# Altium schematic sheet Reference.SchDoc
size A4; CompanyName: Technische Hochschule Nürnberg Georg Simon Ohm; Organization: UltraZohm; Address1: Kesslerplatz 12; Address2: 90489 Nürnberg; Address3: GERMANY; SheetNumber: 4; SheetTotal: 8; Website: www.ultrazohm.com
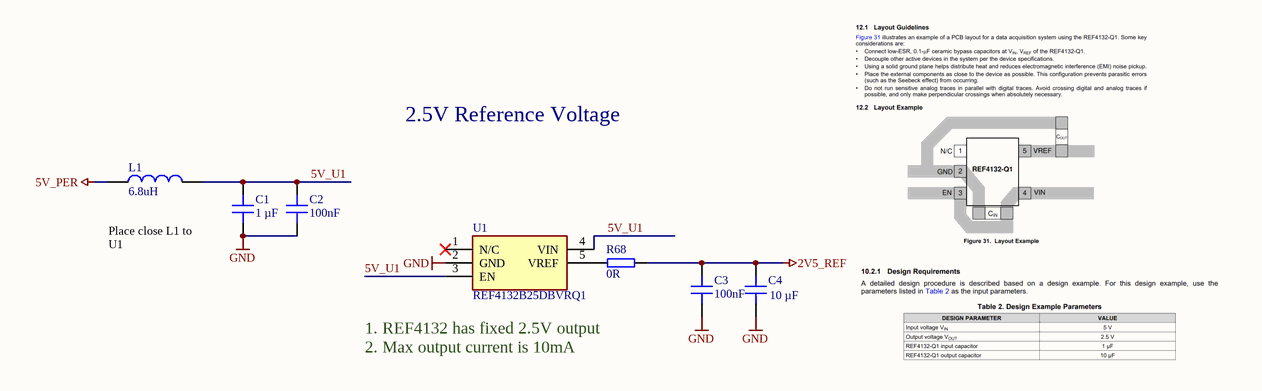
[diagram p0: Reference.SchDoc]

## Parts
C1  1 µF  [C_0603]
C2  100nF  [C_0603]
C3  100nF  [C_0603]
C4  10 µF  [C_0805]
L1  6.8uH  [INDC1608X95N]
R68  0R  [RES 0603_1608]
U1  REF4132B25DBVRQ1  [SOT95P280X145-5N]

## Nets
2V5_REF: C3.2 C4.2 R68.2
5V_PER: L1.1
GND: C1.1 C2.1 C3.1 C4.1 U1.2(GND)
5V_U1: C1.2 C2.2 L1.2 U1.3(EN) U1.4(VIN)
NetR68_1: R68.1 U1.5(VREF)

Not connected (* = marked no-connect by the designer): U1 1(N/C)*

## Notes on the sheet
- 2.5V Reference Voltage
- Place close L1 to U1
- 1. REF4132 has fixed 2.5V output
  2. Max output current is 10mA
- Title
- Revision:
- Design Engineer:
- Date:
- Project:
- Sheet
- of

## Library data of the parts
C1 = UMK107AB7105KA-T: 50V 1uF X7R ±10% 0603 Multilayer Ceramic Capacitors MLCC - SMD/SMT ROHS; Manufacturer: Taiyo Yuden; Voltage Rating: 50 VDC; Created from: NDiringer; Manufacturer Part Number: UMK107AB7105KA-T; PartID: 98; Created On: 8/9/2022 9:35:02 AM; ComponentLink1Description: Datasheet; ComponentLink1URL: https://www.mouser.de/datasheet/2/396/mlcc02_e-1307760.pdf; Component Type: Capacitor 0603; Device Package: 0603; Last Updated: 9/21/2022 4:11:37 PM; Mounting Type: SMD; Operating Temperature: -55 - 125°C; Series: X7R; Supplier 1: LCSC; Supplier Part Number 1: C105174; Type: Capacitor; Tolerance: 10 %; Value: 1 µF; Live Cycle Status: 1; Stock number: not stored; LCSC Part Number: C105174; Supplier 2: Mouser; Supplier Part Number 2: 963-UMK107AB7105MA-T
C2 C3 = CGA3E3X8R1H104KT0Y0N: 50V 100nF X8R ±10% 0603; Manufacturer: TDK; Voltage Rating: 50 VDC; Created from: KIlhan; Manufacturer Part Number: CGA3E3X8R1H104KT0Y0N; PartID: 131; Created On: 7/5/2023 7:32:58 PM; ComponentLink1Description: Datasheet; ComponentLink1URL: https://datasheet.lcsc.com/lcsc/2304140030_TDK-CGA3E3X8R1H104KT0Y0N_C342825.pdf; Component Type: Capacitor 0603; Device Package: 0603; Last Updated: 7/5/2023 7:32:58 PM; Mounting Type: SMD; Operating Temperature: -55 - 125°C; Series: CGA; Supplier 1: LCSC; Supplier Part Number 1: C342825; Type: Capacitor; Tolerance: 10 %; Value: 100nF; Live Cycle Status: 1; Stock number: not stored; LCSC Part Number: C342825
C4 = GRM219R61E106KA12D: Capacitor 0805, 25 VDC, 10 µF, X5R; Manufacturer: muRata; Tolerance: 10 %; Voltage Rating: 25 VDC; Created from: MGremer; Manufacturer Part Number: GRM219R61E106KA12D; PartID: 13; Created On: 12/20/2020 1:54:13 PM; ComponentLink1Description: Datasheet; ComponentLink1URL: https://www.mouser.de/datasheet/2/281/murata_03052018_GRM_Series_1-1310166.pdf; Component Type: Capacitor 0805; Device Package: 0805; Last Updated: 5/27/2022 2:14:39 PM; Mounting Type: SMD; Operating Temperature: -55 - 85°C; Series: GRM; Supplier 1: Mouser; Supplier Part Number 1: 81-GRM219R61E106KA2D; Type: Capacitor; Value: 10 µF; Live Cycle Status: 1; Stock number: Labor SMD Container; LCSC Part Number: C15850
L1 = CMCW1608F6R8KTT: 6.8uH ±10% 0603 Inductors (SMD) ROHS; Manufacturer: Cybermax; MF: EPCOS / TDK; DCR: 320m; Rated Current: 0.85 A; Type: fixed inductor; DC current: 15mA; Created from: KIlhan; MPN: B82464G4154M; Supplier 1: LCSC; Supplier Part Number 1: C961362; Value: 6.8uH; Manufacturer Part Number: CMCW1608F6R8KTT; PartID: 17; Created On: 7/5/2023 8:42:04 PM; ComponentLink1Description: Datasheet; ComponentLink1URL: https://jlcpcb.com/partdetail/Cybermax-CMCW1608F6R8KTT/C961362; Component Type: SMD fixed inductor; Device Package: SMD; Last Updated: 7/5/2023 8:42:04 PM; Mounting Type: SMD; Operating Temperature: -40 - 85 °C; Live Cycle Status: 1; LCSC Part Number: C961362; Stock number: C961362
R68 = RC0603JR-070RL: SMD resistor E24 series; Manufacturer: YAGEO; Tolerance: 5%; Created from: MGremer; Manufacturer Part Number: RC0603JR-070RL; PartID: 1; Created On: 12/14/2020 4:17:14 PM; ComponentLink1Description: Datasheet; ComponentLink1URL: https://www.mouser.de/datasheet/2/447/PYu-RC_Group_51_RoHS_L_10-1664068.pdf; Component Type: SMD resistor; Device Package: 0603; Last Updated: 3/4/2021 9:09:42 AM; Mounting Type: SMD; Supplier 1: Mouser; Supplier Part Number 1: 603-RC0603JR-070RL; Type: Resistor; Value: 0R; Live Cycle Status: 1; Stock number: Labor SMD Container; LCSC Part Number: C21189; Supplier 2: LCSC; Supplier Part Number 2: C21189
U1 = REF4132B25DBVRQ1: Voltage Reference, 2.5V, ±0.05%, ±10mA; Manufacturer: Texas Instruments; Created from: DHufnagel; Manufacturer Part Number: REF4132B25DBVRQ1; PartID: 10; Created On: 7/8/2022 12:48:56 PM; ComponentLink1Description: Datasheet; ComponentLink1URL: https://www.ti.com/general/docs/suppproductinfo.tsp?distId=26&gotoUrl=https://www.ti.com/lit/gpn/ref4132-q1; Component Type: Voltage Reference; Device Package: SMD; Last Updated: 6/15/2023 3:52:51 PM; Mounting Type: SMD; Operating Temperature: -40 - 125 °C; Series: -40 - 125 °C; Supplier 1: Mouser; Supplier Part Number 1: 595-REF4132B25DBVRQ1; Supplier 2: Digi-Key; Supplier Part Number 2: 296-REF4132B25DBVRQ1CT-ND; Type: Voltage Reference; Value: 2.5 V; Live Cycle Status: 1; LCSC Part Number: C2871658; Stock number: not stored